# EAGLE design vybijec (EAGLE 7.2.0)
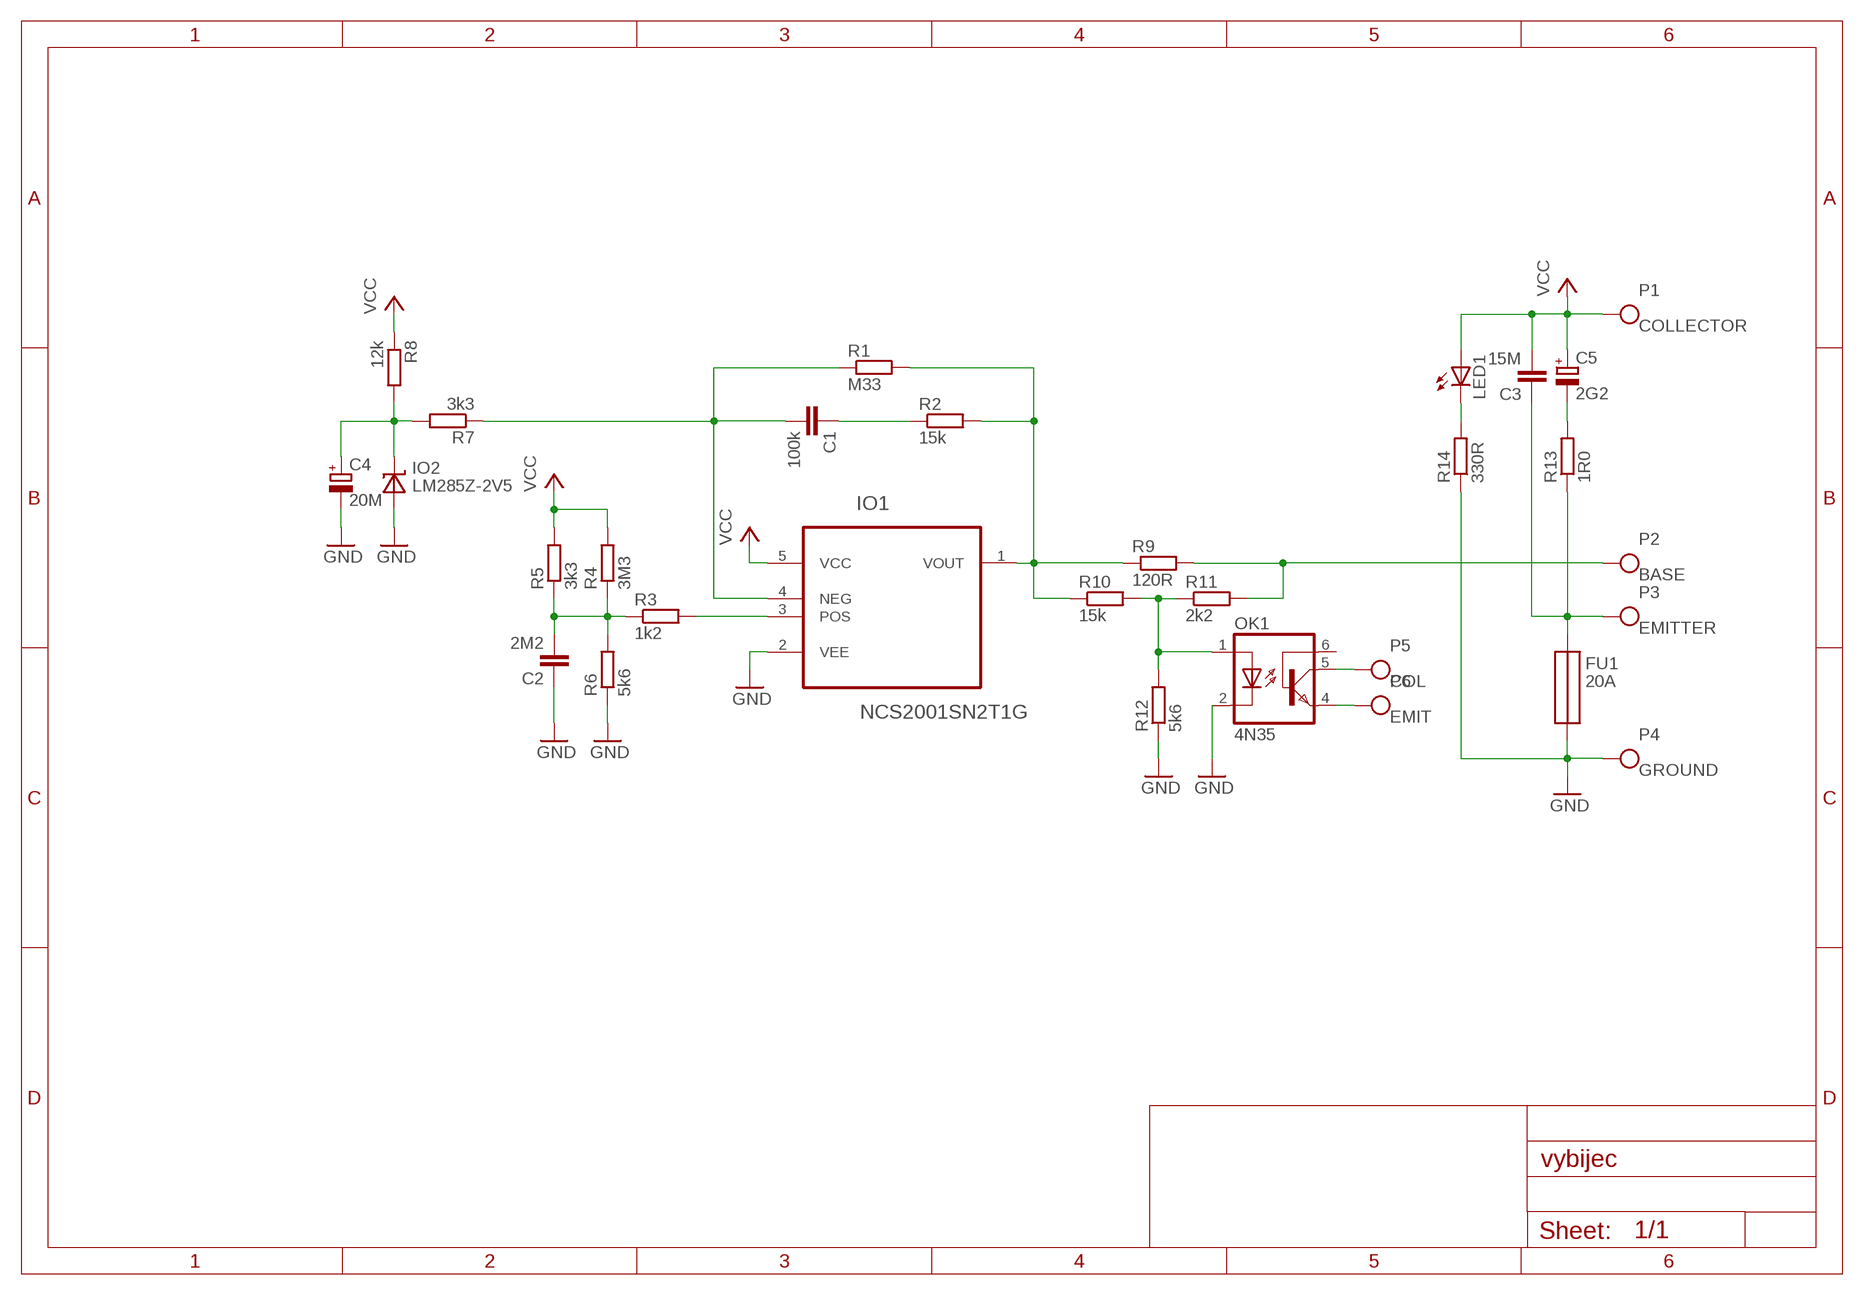
[diagram p0: schematic, sheet 1]

## Parts
C1  100k  C-EU050-025X075  [C050-025X075]
C2  2M2  C-EU050-050X075  [C050-050X075]
C3  15M  C-EU050-075X075  [C050-075X075]
C4  20M  CPOL-EUE22-6AXIAL  [E22-6]
C5  2G2  CPOL-EUE5-10.5  [E5-10,5]
FU1  20A  POJISTKA  [POJ20X6]
IO1  NCS2001SN2T1G  [SOT95P275X110-5N]
IO2  LM285Z-2V5  [TO92-]
LED1  LED3MM  [LED3MM]
OK1  4N35  [DIL06]
P1  COLLECTOR  PADPAD3MM  [PAD3MM]
P2  BASE  PADPAD3MM  [PAD3MM]
P3  EMITTER  PADPAD3MM  [PAD3MM]
P4  GROUND  PADPAD3MM  [PAD3MM]
P5  COL  PADPAD1.6MM  [PAD1.6MM]
P6  EMIT  PADPAD1.6MM  [PAD1.6MM]
R1  M33  R-EU_0207/10  [0207/10]
R2  15k  R-EU_0207/10  [0207/10]
R3  1k2  R-EU_0207/10  [0207/10]
R4  3M3  R-EU_0207/10  [0207/10]
R5  3k3  R-EU_0207/10  [0207/10]
R6  5k6  R-EU_0207/10  [0207/10]
R7  3k3  R-EU_0207/10  [0207/10]
R8  12k  R-EU_0207/10  [0207/10]
R9  120R  R-EU_0207/10  [0207/10]
R10  15k  R-EU_0207/10  [0207/10]
R11  2k2  R-EU_0207/10  [0207/10]
R12  5k6  R-EU_0207/10  [0207/10]
R13  1R0  R-EU_R1206  [R1206]
R14  330R  R-EU_0207/10  [0207/10]

## Nets
GND: C2.1 C4.- FU1.2-1 FU1.2-2 FU1.2-3 FU1.2-4 IO1.2(VEE) IO2.1(ANODE) OK1.2(C) P4.1 R6.1 R12.1 R14.1
N$1: C1.1 R2.1
N$2: IO1.1(VOUT) R1.2 R2.2 R9.1 R10.1
N$3: C4.+ IO2.2(KATODE) R7.2 R8.2
N$4: C1.2 IO1.4(NEG) R1.1 R7.1
N$5: IO1.3(POS) R3.2
N$6: C2.2 R3.1 R4.1 R5.1 R6.2
N$7: C3.1 FU1.1-1 FU1.1-2 FU1.1-3 FU1.1-4 P3.1 R13.1
N$8: OK1.1(A) R10.2 R11.1 R12.2
N$9: P2.1 R9.2 R11.2
N$10: OK1.5(COL) P5.P$1
N$11: OK1.4(EMI) P6.P$1
N$12: LED1.K(C) R14.2
N$14: C5.- R13.2
VCC: C3.2 C5.+ IO1.5(VCC) LED1.A P1.1 R4.2 R5.2 R8.1
Unconnected: OK1.6(BAS)

## Library data of the parts
C1-C3 = rcl:C-EU: CAPACITOR, European symbol
C4 C5 = rcl:CPOL-EU: POLARIZED CAPACITOR, European symbol
FU1 = pojistka:POJISTKA
IO1 = NCS2001:NCS2001SN2T1G: Verze SN2T1, prohozene VEE a VCC
IO2 = LM285:LM285Z-2V5: Napetova reference 2,5 V
LED1 = adafruit:LED: LED OSRAM: - CHIPLED LG R971, LG N971, LY N971, LG Q971, LY Q971, LO R971, LY R971 LH N974, LH R974 LS Q976, LO Q976, LY Q976 LO Q996 - Hyper CHIPLED LW Q18S LB Q993, LB Q99A, LB R99A - SideLED LS A670, LO A670, LY A670, LG A670, LP A670 LB A673, LV A673, LT A673, LW A673 LH A674 LY A675 LS A676, LA A676, LO A676, LY A676, LW A676 LS A679, LY A679, LG A679 - Hyper Micro SIDELED® LS Y876, LA Y876, LO Y876, LY Y876 LT Y87S - SmartLED LW L88C, LW L88S LB L89C, LB L89S, LG L890 LS L89K, LO L89K, LY L89K LS L896, LA L896, LO L896, LY L896 - TOPLED LS T670, LO T670, LY T670, LG T670, LP T670 LSG T670, LSP T670, LSY T670, LOP T670, LYG T670 LG T671, LOG T671, LSG T671 LB T673, LV T673, LT T673, LW T673 LH T674 LS T676, LA T676, LO T676, LY T676, LB T676, LH T676, LSB T676, LW T676 LB T67C, LV T67C, LT T67C, LS T67K, LO T67K, LY T67K, LW E67C LS E67B, LA E67B, LO E67B, LY E67B, LB E67C, LV E67C, LT E67C LW T67C LS T679, LY T679, LG T679 LS T770, LO T770, LY T770, LG T770, LP T770 LB T773, LV T773, LT T773, LW T773 LH T774 LS E675, LA E675, LY E675, LS T675 LS T776, LA T776, LO T776, LY T776, LB T776 LHGB T686 LT T68C, LB T68C - Hyper Mini TOPLED® LB M676 - Mini TOPLED Santana® LG M470 LS M47K, LO M47K, LY M47K Source: http://www.osram.convergy.de/
OK1 = optocoupler:4N35: MOTOROLA OPTO COUPLER; MF: FAIRCHILD SEMICONDUCTOR; MPN: 4N35; OC_FARNELL: 1328375; OC_NEWARK: 72K9946
P1-P4 = PADs:PAD: Pady pro nyty; DIAMETER: 3mm
P5 P6 = PADs:PAD: Pady pro nyty
R1-R14 = rcl:R-EU_: RESISTOR, European symbol

## Board
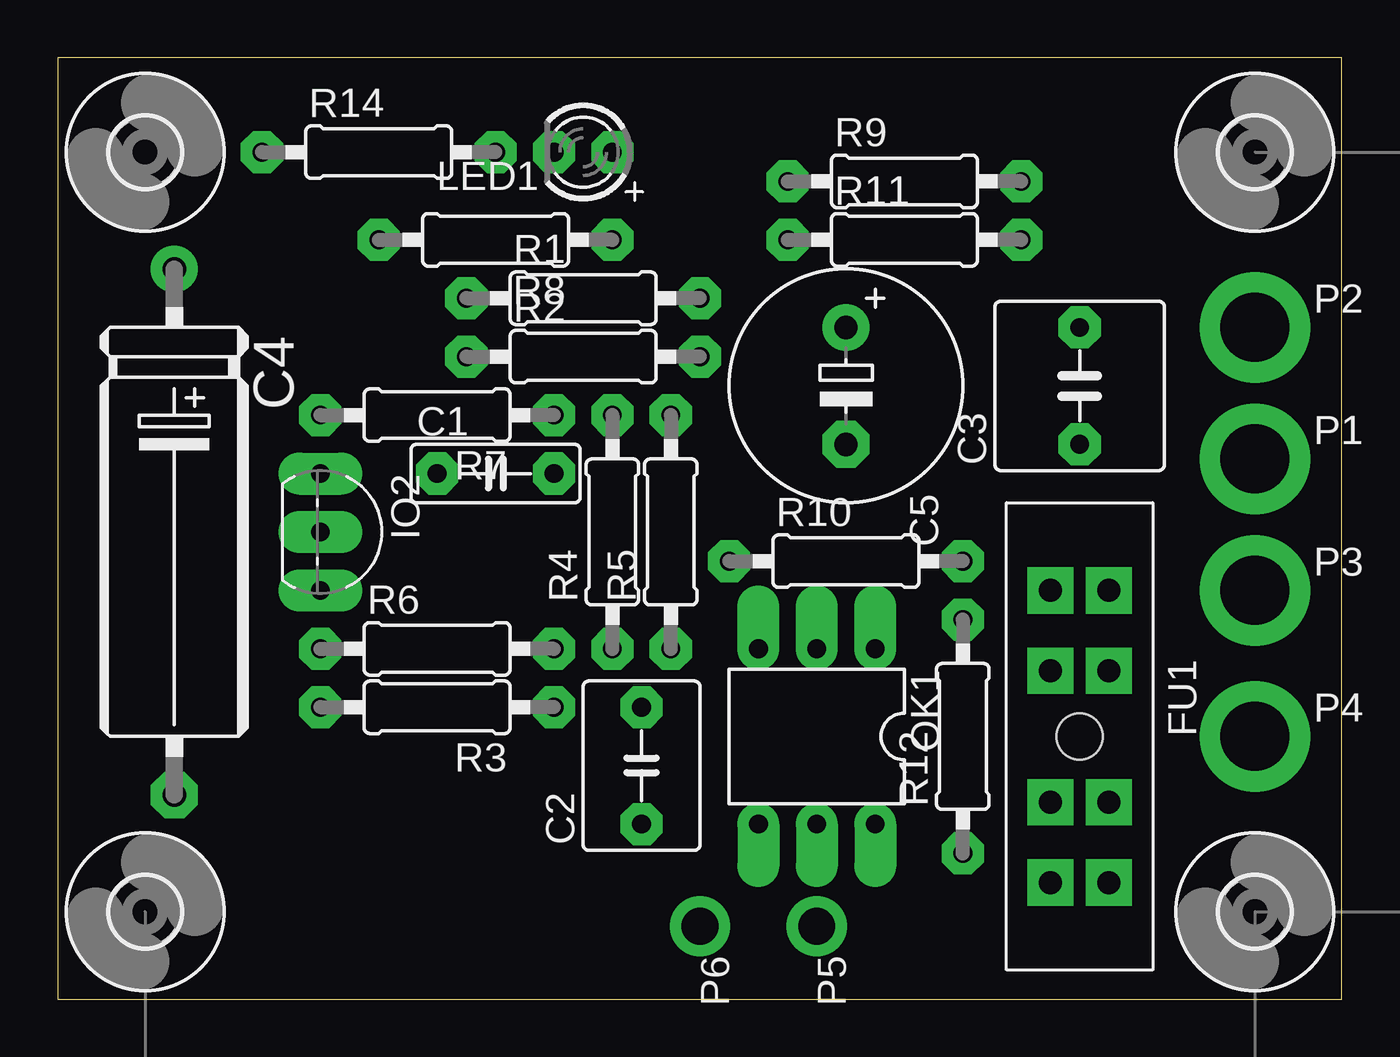
[diagram p1: board, top side]
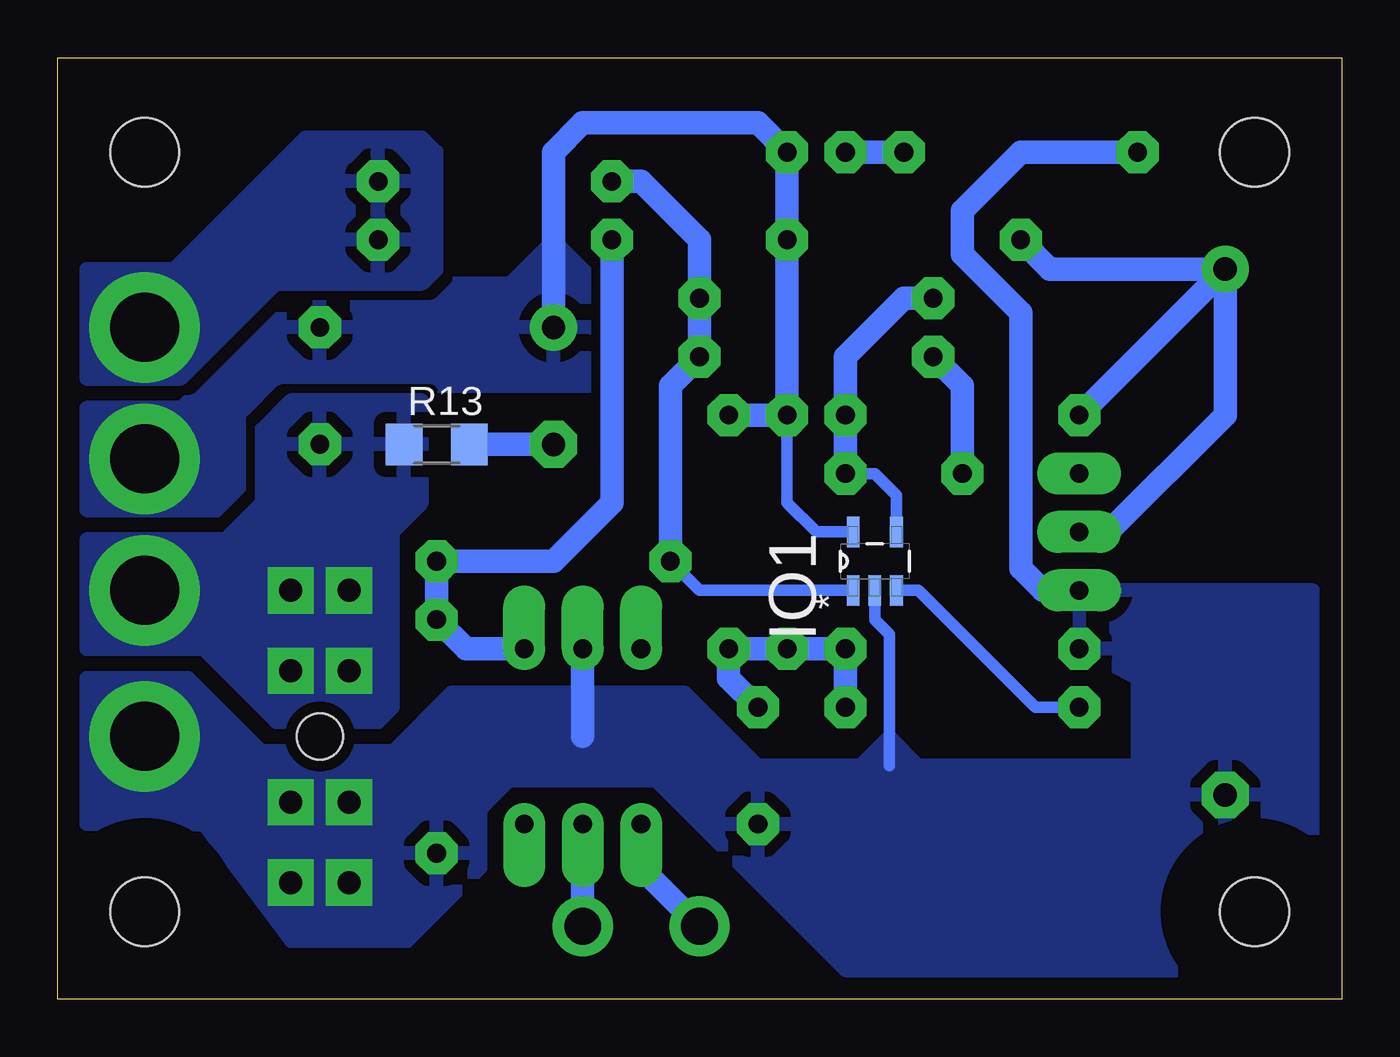
[diagram p2: board, bottom side, seen from below]

Size 55.86 x 40.95 mm. Coordinates in mm from the lower left corner, seen from the top.
Outline: 0,0 55.86,0 55.86,40.95 0,40.95 0,0
Copper layers (1*16): Top 0.035mm / dielectric 1.5mm / Bottom 0.035mm
Design rules "designRules *": minimum track width 10mil, minimum drill 24mil, track to track 16mil, track to pad 10mil, pad to pad 8mil, via to via 8mil, smd to smd 8mil, copper to edge 20mil, drill to drill 8mil, minimum pad ring 20mil, minimum via ring 8mil, stop-mask expansion 4mil, vias tented up to drill 0mil, thermal gap 20mil

### Footprints (pad centres in the part's own frame; a part is rotated, then mirrored left to right if it is on the bottom)
C050-025X075 = drill 0.813 octagon: 1 -2.54,0; 2 2.54,0
C050-050X075 = drill 0.813 octagon: 1 -2.54,0; 2 2.54,0
C050-075X075 = drill 0.813 octagon: 1 -2.54,0; 2 2.54,0
E22-6 = drill 1.016: + -11.43,0 | drill 1.016 octagon: - 11.43,0
E5-10,5 = drill 1.016: + -2.54,0 | drill 1.016 octagon: - 2.54,0
POJ20X6 = drill 1 square: 1-1 1.27,6.35; 1-2 -1.27,6.35; 1-3 1.27,2.857; 1-4 -1.27,2.857; 2-1 1.27,-2.857; 2-2 -1.27,-2.857; 2-3 1.27,-6.35; 2-4 -1.27,-6.35 | hole 2: 0,0
SOT95P275X110-5N = smd 1.321 x 0.559: 1 -1.27,0.94; 2 -1.27,0; 3 -1.27,-0.94; 4 1.27,-0.94; 5 1.27,0.94
TO92- = drill 0.813 long: 1 2.54,0; 2 0,0; 3 -2.54,0
LED3MM = drill 0.813 pad 1.676 octagon: A -1.27,0; K 1.27,0
DIL06 = drill 0.813 offset: 1 -2.54,-3.81; 2 0,-3.81; 3 2.54,-3.81; 4 2.54,3.81; 5 0,3.81; 6 -2.54,3.81
PAD3MM = drill 3 pad 4: 1 0,0
PAD1.6MM = drill 1.6: P$1 0,0
0207/10 = drill 0.813 octagon: 1 -5.08,0; 2 5.08,0
R1206 = smd 1.6 x 1.803: 1 -1.422,0; 2 1.422,0
3,0 = hole 3: 0,0

### Placement (x,y rotation side)
C1  19.05,22.86 0 top
C2  25.4,10.16 90 top
C3  44.45,26.67 90 top
C4  5.08,20.32 270 top
C5  34.29,26.67 270 top
FU1  44.45,11.43 0 top
IO1  20.32,19.05 90 bottom
IO2  11.43,20.32 270 top
LED1  22.86,36.83 180 top
OK1  33.02,11.43 180 top
P1  52.07,23.5 0 top
P2  52.07,29.21 0 top
P3  52.07,17.78 0 top
P4  52.07,11.43 0 top
P5  33.02,3.17 270 top
P6  27.94,3.17 270 top
R1  22.86,30.48 0 top
R2  22.86,27.94 0 top
R3  16.51,12.7 180 top
R4  24.13,20.32 90 top
R5  26.67,20.32 90 top
R6  16.51,15.24 0 top
R7  16.51,25.4 180 top
R8  19.05,33.02 180 top
R9  36.83,35.56 0 top
R10  34.29,19.05 0 top
R11  36.83,33.02 0 top
R12  39.37,11.43 90 top
R13  39.37,24.13 0 bottom
R14  13.97,36.83 0 top
U$1  [3,0]  3.81,3.81 0 top
U$2  [3,0]  3.81,36.83 0 top
U$3  [3,0]  52.07,3.81 0 top
U$4  [3,0]  52.07,36.83 0 top

### Tracks (layer width: path | path; a pad name or v marks a point on that pad's centre or on a via)
GND
  Bottom 0.508: IO1.2 20.32,16.51 19.68,15.88 19.68,10.16
  Bottom 1.016: OK1.2 33.02,11.43 | R14.1 13.97,36.83 16.51,34.29 16.51,32.38 13.97,29.84 13.97,18.73 13.02,17.78 IO2.1
  pour Bottom: 50.16,13.97 54.61,13.97 54.61,7.62 49.53,7.62 45.72,2.54 40.64,2.54 37.47,5.71 37.47,8.26 36.2,9.53 29.84,9.53 21.59,1.27 1.27,1.27 1.27,17.78 11.43,17.78 11.43,15.24 8.89,13.97 8.89,10.16 18.41,10.16 19.68,11.43 20.95,10.16 25.4,10.16 28.57,13.34 38.73,13.34 41.27,10.79 46.99,10.79
N$1
  Bottom 1.016: C1.1 16.51,26.67 R2.1
N$2
  Bottom 0.508: IO1.1 27.94,17.78 R10.1
  Bottom 1.016: R9.1 30.48,35.56 27.94,33.02 R1.2 R2.2 29.21,26.67 R10.1
N$3
  Bottom 1.016: R8.2 12.7,31.75 C4.+ | R7.2 C4.+ | IO2.2 10.16,20.32 5.08,25.4 C4.+
N$4
  Bottom 0.508: C1.2 20.32,22.86 19.38,21.92 IO1.4
  Bottom 1.016: R1.1 19.05,30.48 21.59,27.94 R7.1 C1.2
N$5
  Bottom 0.508: R3.2 13.34,12.7 18.41,17.78 IO1.3
N$6
  Bottom 1.016: R3.1 R6.2 R4.1 R5.1 26.67,13.97 C2.2
N$7
  pour Bottom: 46.99,21.59 48.58,20 54.61,20 54.61,15.24 49.53,15.24 46.35,12.06 41.91,12.06 41.27,12.7 41.27,20.32 40.01,21.59 40.01,26.04 45.72,26.04 46.99,24.77
N$8
  Bottom 1.016: OK1.1 38.1,15.24 R12.2 R10.2 34.29,19.05 31.75,21.59 R11.1
N$9
  pour Bottom: 54.61,26.99 50.48,26.99 46.35,31.11 40.01,31.11 39.37,31.75 39.37,36.83 40.01,37.47 45.09,37.47 50.8,31.75 54.61,31.75
N$10
  Bottom 1.016: P5.P$1 OK1.5
N$11
  Bottom 1.016: OK1.4 30.48,5.71 P6.P$1
N$12
  Bottom 1.016: LED1.K R14.2
N$14
  Bottom 1.016: R13.2 C5.-
VCC
  Bottom 0.508: IO1.5 22.86,20.32 24.13,21.59 R4.2
  Bottom 1.016: R5.2 R4.2 R8.1 LED1.A 25.4,38.1 29.21,38.1 33.02,38.1 34.29,36.83 C5.+
  pour Bottom (rank 2): 32.38,26.67 32.38,31.11 34.29,33.02 36.2,31.11 45.09,31.11 50.48,25.72 54.61,25.72 54.61,21.27 48.58,21.27 47.62,22.23 47.62,25.4 46.35,26.67